# Altium schematic sheet 01_MAIN.SchDoc: =GlobalProjectName
size 209 x 297 mm; CheckedBy: A_D; Author: A_D; SheetNumber: 1; SheetTotal: 3; PageSetup: Record=PageOptions|CenterHorizontal=True|CenterVertical=True|PrintScale=0.70|XCorrection=1.00|YCorrection=1.00|PrintKind=2|BorderSize=5000000|LeftOffset=9000|BottomOffset=10100|Orientation=2|PaperLength=11176|PaperWidth=8636|Scale=100|PaperSource=259|PrintQuality=-3|MediaType=1|DitherType=10|PrintScaleMode=1|PaperKind=A3|PaperIndex=8
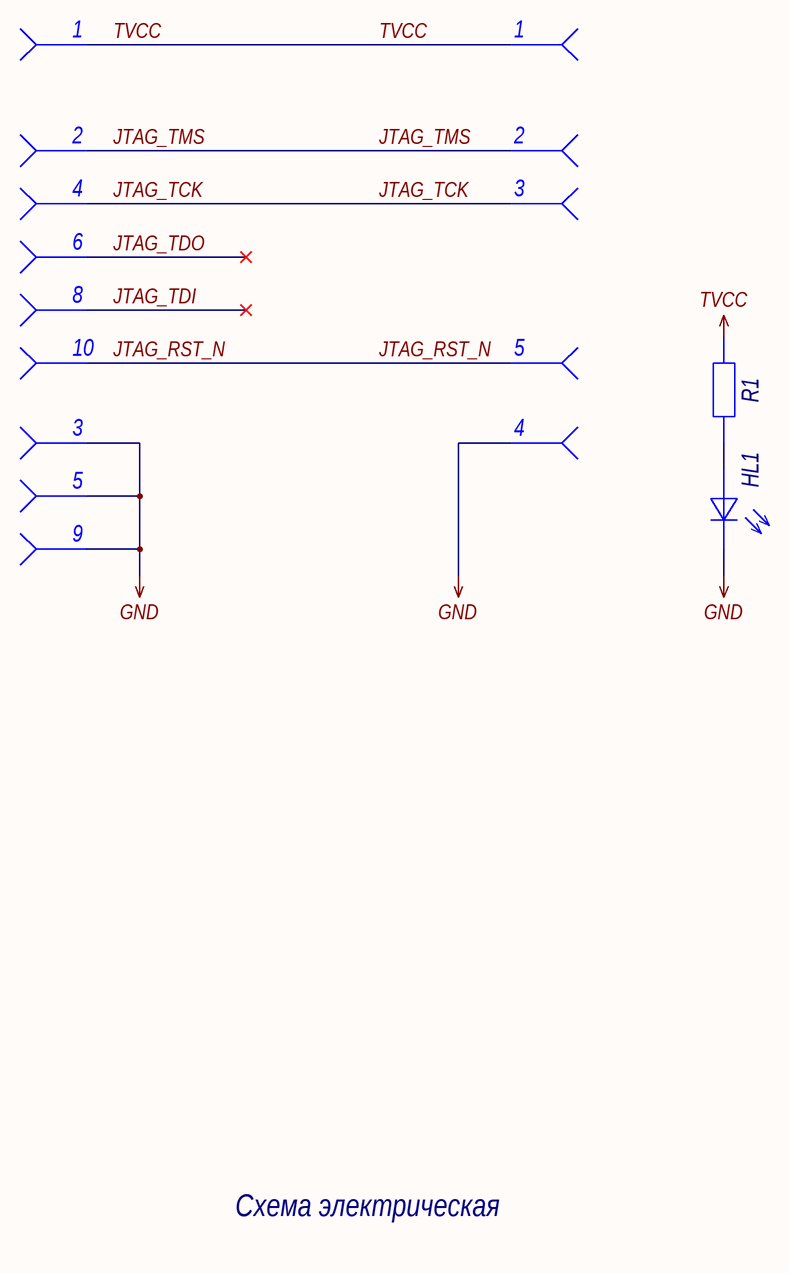
[diagram p0: 01_MAIN.SchDoc]

## Parts
HL1  TVCC  [LD0402_L]  (value not drawn)
R1  Resistor  [R0402_L]  (value not drawn)
XS1  JTAG  [XF2M-1015-1A]  (value not drawn)  (parts A,B,C,D,E,F,H,I,J of 10)
XS2  SWD  [PBS-5]  (value not drawn)  (parts A,B,C,D,E of 5)

## Nets
GND: HL1.2(К) XS1.3 XS1.5 XS1.9 XS2.4
TVCC: R1.2 XS1.1 XS2.1
JTAG_RST_N: XS1.10 XS2.5
JTAG_TCK: XS1.4 XS2.3
JTAG_TDI: XS1.8
JTAG_TDO: XS1.6
JTAG_TMS: XS1.2 XS2.2
NetHL1_1: HL1.1(А) R1.1

## Notes on the sheet
- Схема электрическая
  принципиальная
- Перв. примен.
- Справ. №
- Подп. и дата
- Инв. № дубл.
- Взам. инв. №
- Разраб.
- Изм.
- Лист
- № докум.
- Подп.
- Дата
- Литера
- Масса
- Масштаб
- Пров.
- Т.контр.
- Листов
- Инв. № подл.
- Н.контр.
- Утв.
- Форма 1 ГОСТ 2.104-2006
- Копировал
- Формат А4

## Library data of the parts
HL1 = KPHHS-1005QBC-D-V: Manufacturer: Kingbright; Type: Индикатор единичный; ID: 24; Forward Voltage: 3.3V; Forward Current: 20mA; Power Dissipation: 120mW; Luminous Flux: 60; Color: Blue; Leds: 1; Working Temperature Min: -40°С; Working Temperature Max: +85°С; Published: 03.12.2013; Publisher: Andrew Danich; Part Number: KPHHS-1005QBC-D-V; Value: KPHHS-1005QBC-D-V; Footprint: 0402; Application Category: 1
R1 = RC0402JR-0710KL: Manufacturer: Yageo; ID: 476; Value: 10k; Limit Voltage: 50V; Tolerance: ±5%; Temperature Coefficient: 100ppm; Total Power Dissipation: 0.1W; Series Type: Thick-Film; Application Category: 1; Working Temperature Min: -55°С; Working Temperature Max: +155°С; Published: 24.03.2010; Publisher: Andrew Danich; Type: Резистор; Part Number: RC0402JR-0710KL; Footprint: 0402
XS1 = XF2M-1015-1A: Manufacturer: Omron Electronics; ID: 7; Limit Voltage: 50V; Limit Current: 500mA; Connector Type: Female; Resistance: 0.05ohm; Pitch: 0.5mm; Application Category: 1; Working Temperature Min: -30°С; Working Temperature Max: +85°С; Published: 07.09.2015; Publisher: Viktor Klishin; Type: Розетка; Part Number: XF2M-1015-1A; Value: XF2M-1015-1A; Pins: 10; Series: FPC
XS2 = PBS-5_S: Value: PBS-5; Published: 07.09.2015; Publisher: Andrew Danich; Type: Розетка